# EAGLE design vilnius_rev_c (EAGLE 6.6.0)

## Sheet 1 of 2
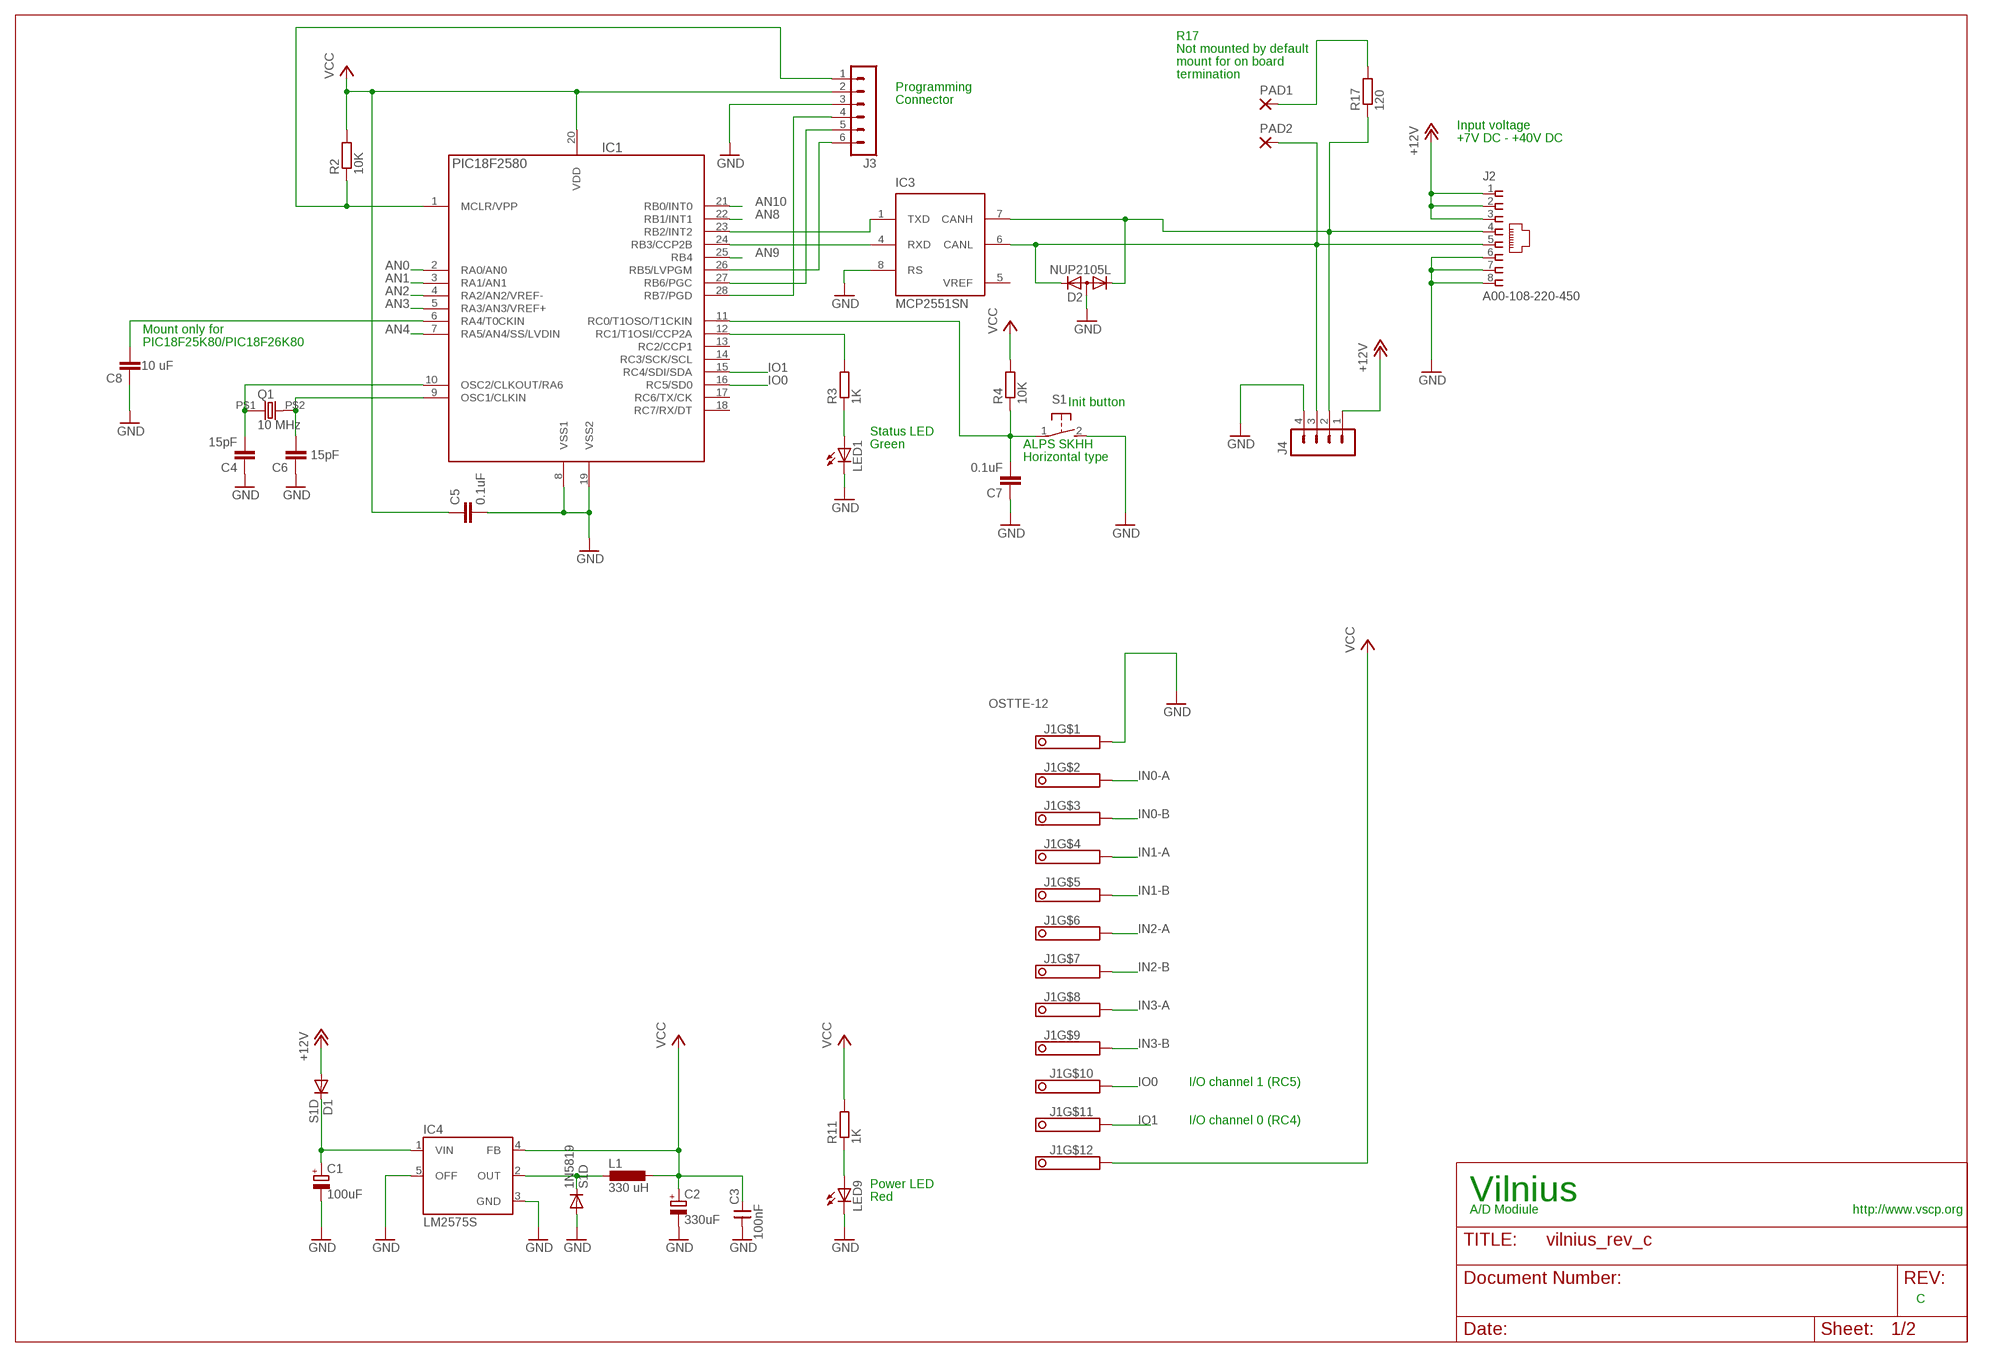
[diagram p0: schematic, sheet 1]

### Parts
1N5819  S1D  DIODE-SOD123  [SOD123]
C1  100uF  CPOL-EUD  [PANASONIC_D]
C2  330uF  CPOL-EUD  [PANASONIC_D]
C3  100nF  CNP-0805  [0805]
C4  15pF  C-EUC0805  [C0805]
C5  0.1uF  C-EUC0805  [C0805]
C6  15pF  C-EUC0805  [C0805]
C7  0.1uF  C-EUC0805  [C0805]
C8  10 uF  C-EUC0805  [C0805]
D1  S1D  DIODE-SOD123  [SOD123]
D2  NUP2105L  DIODE-2CA|ACSOT23  [SOT23@1]
IC1  PIC18F2580  PIC18LF252-I/SO  [SO28]
IC3  MCP2551SN  [SO-08]
IC4  LM2575S  [TO263-5]
J1  OSTTE-12  [PINHEAD-12]
J2  A00-108-220-450  [RJ-45]
J3  MA06-1  [MA06-1]
J4  MA04-1  [MA04-1]
L1  330 uH  DO3316P  [DO3316P]
LED1  LEDCHIP-LED0805  [CHIP-LED0805]
LED9  LEDCHIP-LED0805  [CHIP-LED0805]
PAD1  1,6/0,8  [1,6/0,8]
PAD2  1,6/0,8  [1,6/0,8]
Q1  10 MHz  HC-49S  [9C]
R2  10K  R-EU_R0805  [R0805]
R3  1K  R-EU_R0805  [R0805]
R4  10K  R-EU_R0805  [R0805]
R11  1K  R-EU_R0805  [R0805]
R17  120  R-EU_R0805  [R0805]
S1  31-XX  [B3F-31XX]

### Nets
+12V: D1.A J2.1 J2.2 J2.3 J4.1
AN0: IC1.2(RA0/AN0) ; also sheet 2
AN1: IC1.3(RA1/AN1) ; also sheet 2
AN2: IC1.4(RA2/AN2/VREF-) ; also sheet 2
AN3: IC1.5(RA3/AN3/VREF+) ; also sheet 2
AN4: IC1.7(RA5/AN4/SS/LVDIN)
AN8: IC1.22(RB1/INT1)
AN9: IC1.25(RB4)
AN10: IC1.21(RB0/INT0)
CANL: D2.2(K2) IC3.6(CANL) J2.5 J4.3 PAD2.1(P)
GND: 1N5819.A C1.- C2.- C3.1 C4.1 C5.2 C6.1 C7.1 C8.1 D2.3(A) IC1.8(VSS1) IC1.19(VSS2) IC3.8(RS) IC4.3(GND) IC4.5(OFF) J1.1 J2.6 J2.7 J2.8 J3.3 J4.4 LED1.C LED9.C S1.2(S) ; also sheet 2
IN0-A: J1.2 ; also sheet 2
IN0-B: J1.3 ; also sheet 2
IN1-A: J1.4 ; also sheet 2
IN1-B: J1.5 ; also sheet 2
IN2-A: J1.6 ; also sheet 2
IN2-B: J1.7 ; also sheet 2
IN3-A: J1.8 ; also sheet 2
IN3-B: J1.9 ; also sheet 2
IO0: IC1.16(RC5/SD0) J1.10
IO1: IC1.15(RC4/SDI/SDA) J1.11
N$1: 1N5819.C IC4.2(OUT) L1.1
N$2: C4.2 IC1.10(OSC2/CLKOUT/RA6) Q1.P$1
N$3: C1.+ D1.C IC4.1(VIN)
N$4: IC1.12(RC1/T1OSI/CCP2A) R3.2
N$5: LED1.A R3.1
N$6: C7.2 IC1.11(RC0/T1OSO/T1CKIN) R4.1 S1.1(P)
N$7: C6.2 IC1.9(OSC1/CLKIN) Q1.P$2
N$8: C8.2 IC1.6(RA4/T0CKIN)
N$11: PAD1.1(P) R17.2
N$12: IC1.1(MCLR/VPP) J3.1 R2.1
N$13: IC1.28(RB7/PGD) J3.4
N$14: IC1.27(RB6/PGC) J3.5
N$15: IC1.26(RB5/LVPGM) J3.6
N$20: LED9.A R11.1
N$22: D2.1(K1) IC3.7(CANH) J2.4 J4.2 R17.1
RXCAN: IC1.24(RB3/CCP2B) IC3.4(RXD)
TXCAN: IC1.23(RB2/INT2) IC3.1(TXD)
VCC: C2.+ C3.2 C5.1 IC1.20(VDD) IC4.4(FB) J1.12 J3.2 L1.2 R2.2 R4.2 R11.2 ; also sheet 2
Unconnected: IC1.13(RC2/CCP1) IC1.14(RC3/SCK/SCL) IC1.17(RC6/TX/CK) IC1.18(RC7/RX/DT)

### Notes on the sheet
- R17
- Not mounted by default
- mount for on board
- termination
- Programming
- Connector
- Input voltage
- +7V DC - +40V DC
- Mount only for
- PIC18F25K80/PIC18F26K80
- Init button
- Status LED
- Green | ALPS SKHH
- Horizontal type
- I/O channel 1 (RC5)
- I/O channel 0 (RC4)
- Power LED
- Red | Vilnius
- A/D Modiule | http://www.vscp.org
- C

## Sheet 2 of 2
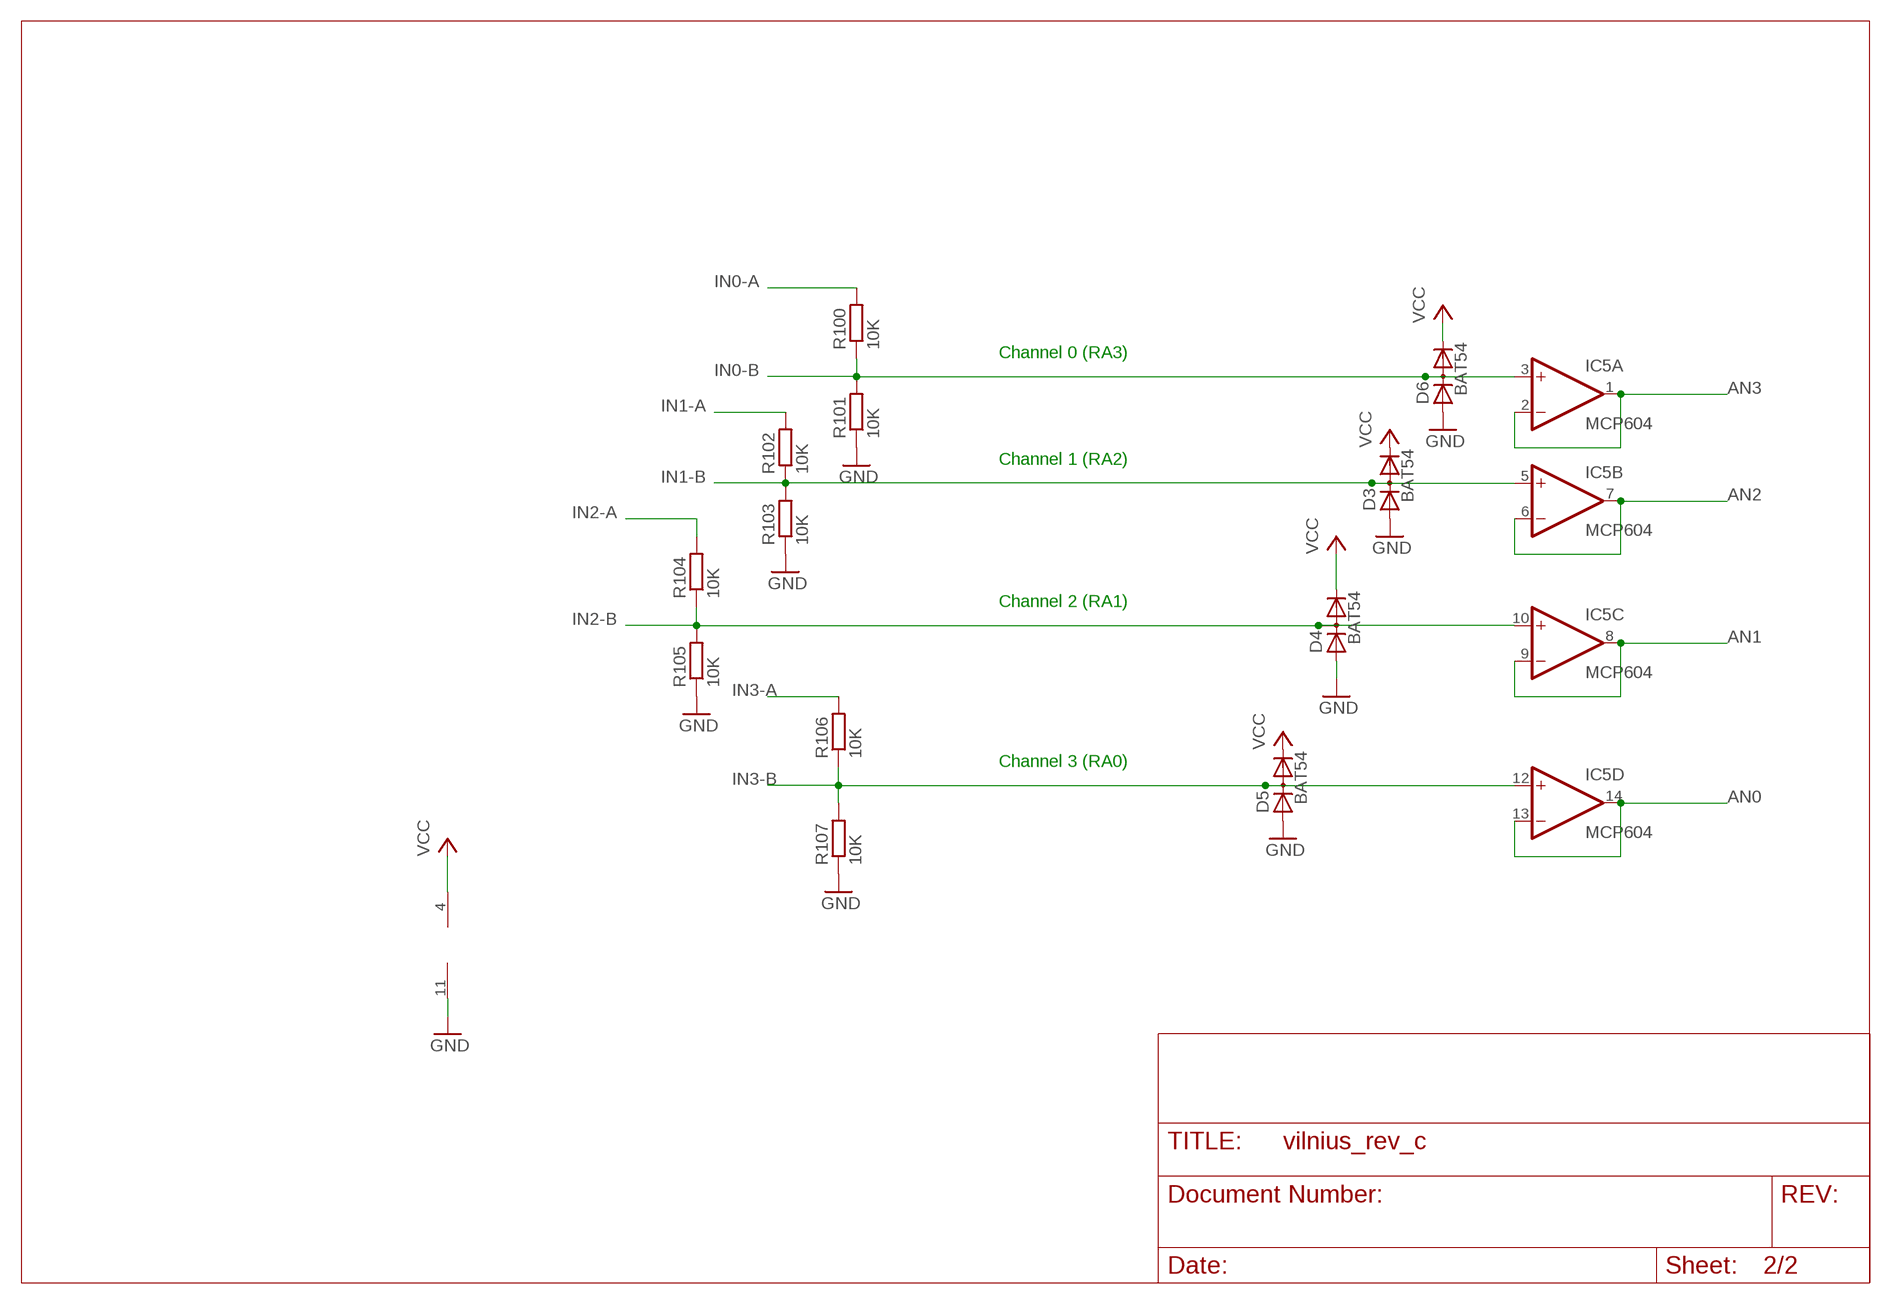
[diagram p1: schematic, sheet 2]

### Parts
D3  BAT54  BAV199  [SOT23]
D4  BAT54  BAV199  [SOT23]
D5  BAT54  BAV199  [SOT23]
D6  BAT54  BAV199  [SOT23]
IC5  MCP604  4AMP_P4+11D  [SO14]
R100  10K  R-EU_R0805  [R0805]
R101  10K  R-EU_R0805  [R0805]
R102  10K  R-EU_R0805  [R0805]
R103  10K  R-EU_R0805  [R0805]
R104  10K  R-EU_R0805  [R0805]
R105  10K  R-EU_R0805  [R0805]
R106  10K  R-EU_R0805  [R0805]
R107  10K  R-EU_R0805  [R0805]

### Nets
AN0: IC5.13(D:-IN) IC5.14(D:OUT) ; also sheet 1
AN1: IC5.8(C:OUT) IC5.9(C:-IN) ; also sheet 1
AN2: IC5.6(B:-IN) IC5.7(B:OUT) ; also sheet 1
AN3: IC5.1(A:OUT) IC5.2(A:-IN) ; also sheet 1
GND: D3.1(A) D4.1(A) D5.1(A) D6.1(A) IC5.11(P:V-) R101.1 R103.1 R105.1 R107.1 ; also sheet 1
IN0-A: R100.2 ; also sheet 1
IN0-B: D6.3(AC) IC5.3(A:+IN) R100.1 R101.2 ; also sheet 1
IN1-A: R102.2 ; also sheet 1
IN1-B: D3.3(AC) IC5.5(B:+IN) R102.1 R103.2 ; also sheet 1
IN2-A: R104.2 ; also sheet 1
IN2-B: D4.3(AC) IC5.10(C:+IN) R104.1 R105.2 ; also sheet 1
IN3-A: R106.2 ; also sheet 1
IN3-B: D5.3(AC) IC5.12(D:+IN) R106.1 R107.2 ; also sheet 1
VCC: D3.2(C) D4.2(C) D5.2(C) D6.2(C) IC5.4(P:V+) ; also sheet 1

### Notes on the sheet
- Channel 0 (RA3)
- Channel 1 (RA2)
- Channel 2 (RA1)
- Channel 3 (RA0)

## Power pins joined to a net without a drawn wire
GND: IC3.2(VSS)
VCC: IC3.3(VDD)
VREF: IC3.5(VREF)

## Library data of the parts
1N5819 D1 = diode:DIODE-: DIODE
C1 C2 = rcl:CPOL-EU: POLARIZED CAPACITOR, European symbol
C3 = cap-master:CNP-: NON-POLARIZED CAP
C4-C8 = rcl:C-EU: CAPACITOR, European symbol
D2 = diode:DIODE-2CA|AC: Dual DIODE Cathode-Anode|Anode-Cathode
D3-D6 = diode:BAV199: DIODE low-leakage double diode
IC1 = pic_olin:PIC18*F252-?: 18F252, 28 pin, 32Kb prog, 1536 data, 256 EEPROM
IC3 = microchip_can:MCP2551: High Speed CAN tranceiver
IC4 = v-reg-3:LM2575: National Semiconductor <http://www.national.com> 1.0A "Simple Switcher"(c) 52kHz, Vout 1.23-37V (HV: 57V), Vin 40V (HV: 60V), 50µA standby current
IC5 = linear:4AMP_P4+11: OP AMP
J1 = vscpcan:OSTTE-12
J2 = vscpcan:A00-108-220-450
J3 = con-lstb:MA06-1: PIN HEADER; OC_FARNELL: unknown; OC_NEWARK: unknown
J4 = con-lstb:MA04-1: PIN HEADER; OC_FARNELL: unknown; OC_NEWARK: unknown
L1 = inductor-coilcraft:DO3316P: COILCRAFT; OC_FARNELL: unknown; OC_NEWARK: unknown
LED1 LED9 = led:LED: LED OSRAM: - CHIPLED LG R971, LG N971, LY N971, LG Q971, LY Q971, LO R971, LY R971 LH N974, LH R974 LS Q976, LO Q976, LY Q976 LO Q996 - Hyper CHIPLED LW Q18S LB Q993, LB Q99A, LB R99A - SideLED LS A670, LO A670, LY A670, LG A670, LP A670 LB A673, LV A673, LT A673, LW A673 LH A674 LY A675 LS A676, LA A676, LO A676, LY A676, LW A676 LS A679, LY A679, LG A679 - Hyper Micro SIDELED® LS Y876, LA Y876, LO Y876, LY Y876 LT Y87S - SmartLED LW L88C, LW L88S LB L89C, LB L89S, LG L890 LS L89K, LO L89K, LY L89K LS L896, LA L896, LO L896, LY L896 - TOPLED LS T670, LO T670, LY T670, LG T670, LP T670 LSG T670, LSP T670, LSY T670, LOP T670, LYG T670 LG T671, LOG T671, LSG T671 LB T673, LV T673, LT T673, LW T673 LH T674 LS T676, LA T676, LO T676, LY T676, LB T676, LH T676, LSB T676, LW T676 LB T67C, LV T67C, LT T67C, LS T67K, LO T67K, LY T67K, LW E67C LS E67B, LA E67B, LO E67B, LY E67B, LB E67C, LV E67C, LT E67C LW T67C LS T679, LY T679, LG T679 LS T770, LO T770, LY T770, LG T770, LP T770 LB T773, LV T773, LT T773, LW T773 LH T774 LS E675, LA E675, LY E675, LS T675 LS T776, LA T776, LO T776, LY T776, LB T776 LHGB T686 LT T68C, LB T68C - Hyper Mini TOPLED® LB M676 - Mini TOPLED Santana® LG M470 LS M47K, LO M47K, LY M47K Source: http://www.osram.convergy.de LUXEON: - LUMILED® LXK2-PW12-R00, LXK2-PW12-S00, LXK2-PW14-U00, LXK2-PW14-V00 LXK2-PM12-R00, LXK2-PM12-S00, LXK2-PM14-U00 LXK2-PE12-Q00, LXK2-PE12-R00, LXK2-PE12-S00, LXK2-PE14-T00, LXK2-PE14-U00 LXK2-PB12-K00, LXK2-PB12-L00, LXK2-PB12-M00, LXK2-PB14-N00, LXK2-PB14-P00, LXK2-PB14-Q00 LXK2-PR12-L00, LXK2-PR12-M00, LXK2-PR14-Q00, LXK2-PR14-R00 LXK2-PD12-Q00, LXK2-PD12-R00, LXK2-PD12-S00 LXK2-PH12-R00, LXK2-PH12-S00 LXK2-PL12-P00, LXK2-PL12-Q00, LXK2-PL12-R00 Source: www.luxeon.com KINGBRIGHT: KA-3528ASYC Source: www.kingbright.com
PAD1 PAD2 = wirepad:1,6/0,8: THROUGH-HOLE PAD
Q1 = vscpcan:HC-49S: Digikey 887-1050-1-nd
R2-R4 R11 R17 R100-R107 = rcl:R-EU_: RESISTOR, European symbol
S1 = switch-omron:31-XX: OMRON SWITCH; MPN: B3F-3100; OC_FARNELL: 959704; OC_NEWARK: 36M3582

## Board
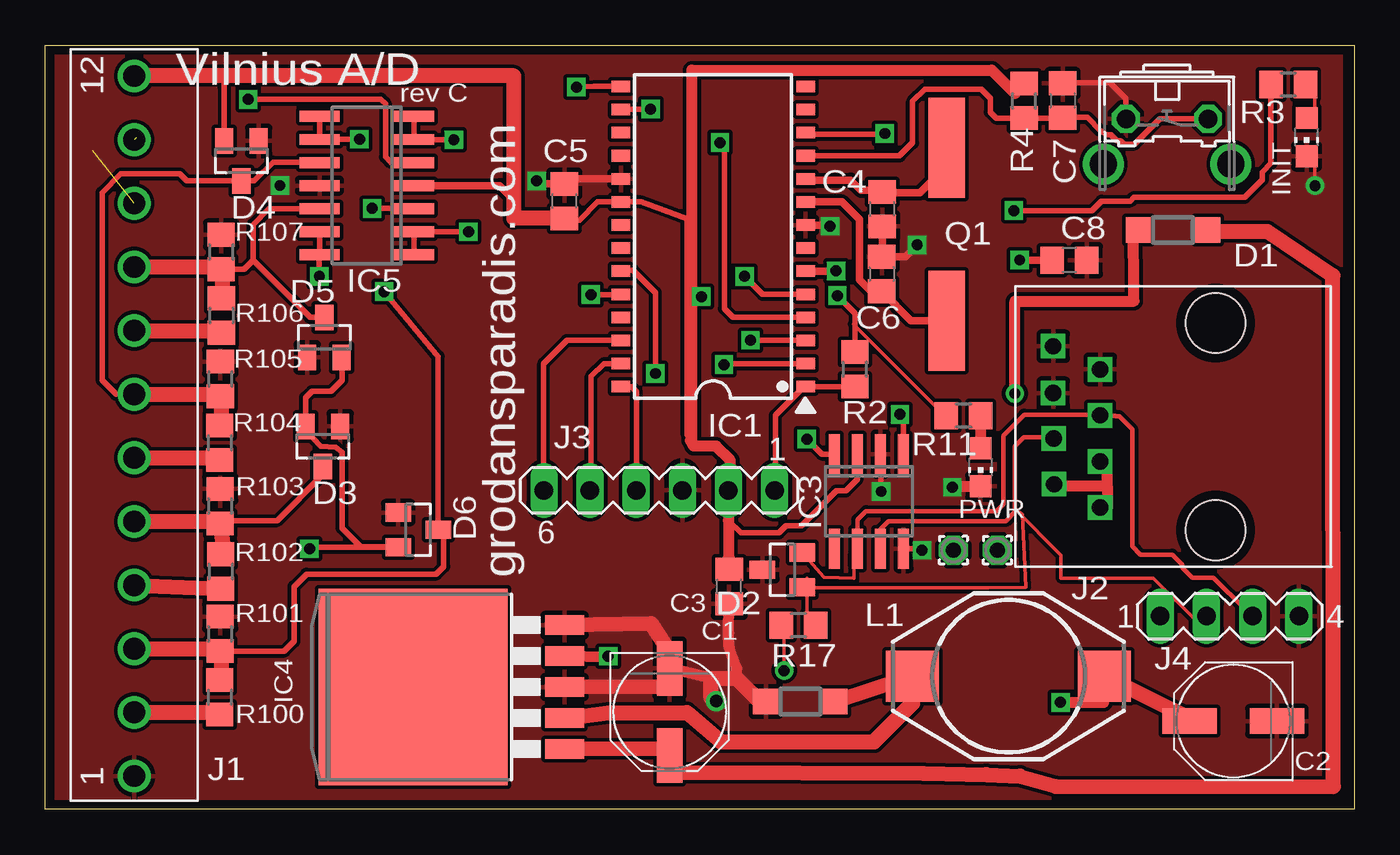
[diagram p2: board, top side]
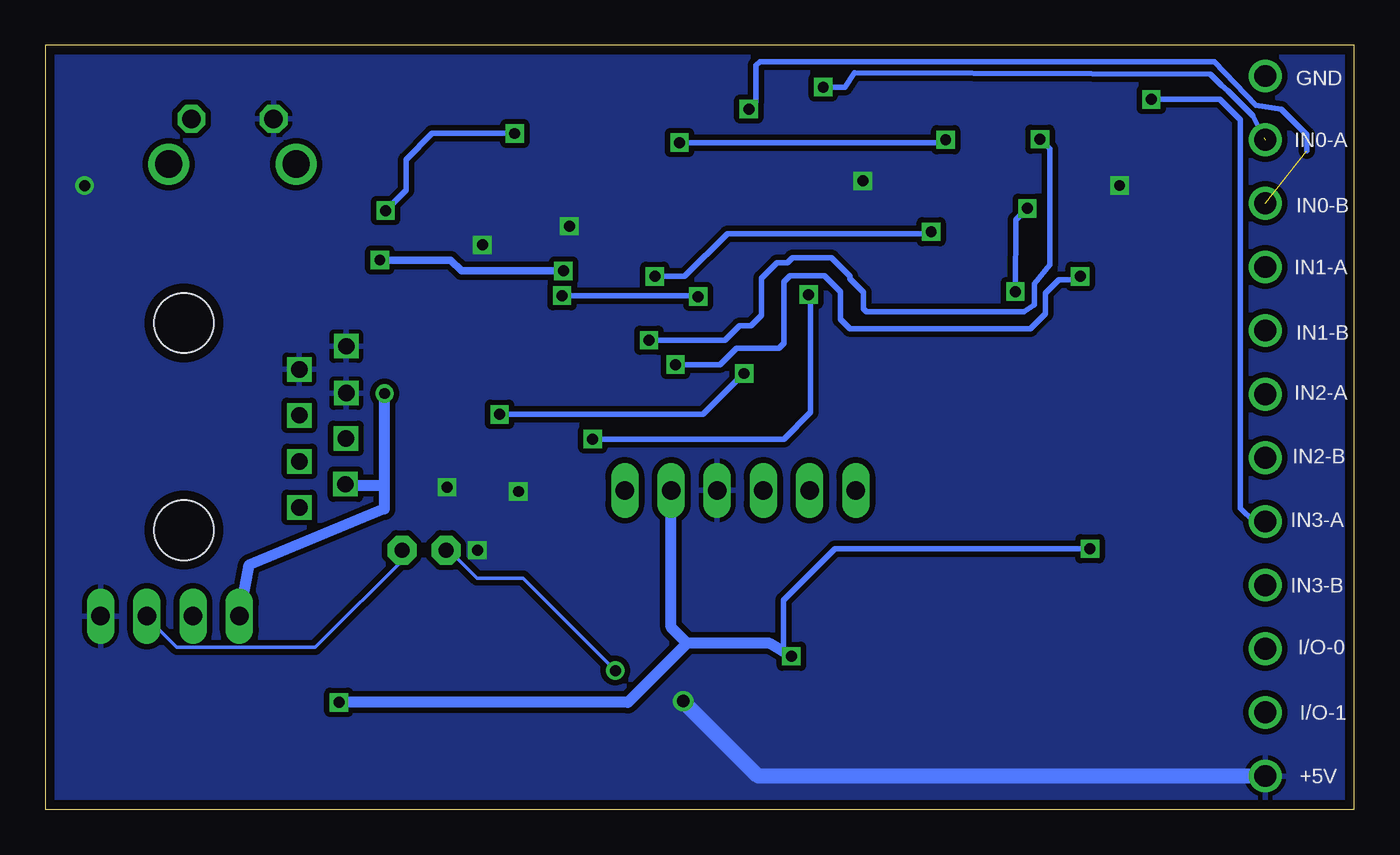
[diagram p3: board, bottom side, seen from below]

Size 72 x 42 mm. Coordinates in mm from the lower left corner, seen from the top.
Outline: 0,0 0,42 72,42 72,0 0,0
Copper layers (1*16): Top 0.035mm / dielectric 1.5mm / Bottom 0.035mm
Design rules "8mils": minimum track width 8mil, minimum drill 0.6mm, track to track 8mil, track to pad 8mil, pad to pad 8mil, via to via 8mil, smd to smd 0mil, copper to edge 20mil, drill to drill 10mil, minimum pad ring 8mil, minimum via ring 8mil, stop-mask expansion 0mil, vias tented up to drill 0mil, thermal gap 10mil

### Footprints (pad centres in the part's own frame; a part is rotated, then mirrored left to right if it is on the bottom)
SOD123 = smd 1.4 x 1.4: A 1.9,0; C -1.9,0
PANASONIC_D = smd 3 x 1.4: + 2.4,0; - -2.4,0
0805 = smd 1.27 x 1.524: 1 -0.953,0; 2 0.953,0
C0805 = smd 1.3 x 1.5: 1 -0.95,0; 2 0.95,0
SOT23@1 = smd 1 x 1.4: 1 -0.95,-1.1; 2 0.95,-1.1; 3 0,1.1
SOT23 = smd 1 x 1.4: 1 -0.95,-1.1; 2 0.95,-1.1; 3 0,1.1
SO28 = smd 0.635 x 1.016: 1 -8.255,-5.08; 2 -6.985,-5.08; 3 -5.715,-5.08; 4 -4.445,-5.08; 5 -3.175,-5.08; 6 -1.905,-5.08; 7 -0.635,-5.08; 8 0.635,-5.08; 9 1.905,-5.08; 10 3.175,-5.08; 11 4.445,-5.08; 12 5.715,-5.08; 13 6.985,-5.08; 14 8.255,-5.08; 15 8.255,5.08; 16 6.985,5.08; 17 5.715,5.08; 18 4.445,5.08; 19 3.175,5.08; 20 1.905,5.08; 21 0.635,5.08; 22 -0.635,5.08; 23 -1.905,5.08; 24 -3.175,5.08; 25 -4.445,5.08; 26 -5.715,5.08; 27 -6.985,5.08; 28 -8.255,5.08
SO-08 = smd 0.6 x 2.2: 1 -1.905,-2.6; 2 -0.635,-2.6; 3 0.635,-2.6; 4 1.905,-2.6; 5 1.905,2.6; 6 0.635,2.6; 7 -0.635,2.6; 8 -1.905,2.6
TO263-5 = smd 1.067 x 2.159: 1 -3.404,-5.791; 2 -1.702,-5.791; 3 0,-5.791; 4 1.702,-5.791; 5 3.404,-5.791 | smd 10.8 x 10.41: 6 0,2.54
SO14 = smd 0.6 x 2.2: 1 -3.81,-2.6; 2 -2.54,-2.6; 3 -1.27,-2.6; 4 0,-2.6; 5 1.27,-2.6; 6 2.54,-2.6; 7 3.81,-2.6; 8 3.81,2.6; 9 2.54,2.6; 10 1.27,2.6; 11 0,2.6; 12 -1.27,2.6; 13 -2.54,2.6; 14 -3.81,2.6
PINHEAD-12 = drill 1.2: 1 -17.5,0; 2 -14,0; 3 -10.5,0; 4 -7,0; 5 -3.5,0; 6 0,0; 7 3.5,0; 8 7,0; 9 10.5,0; 10 14,0; 11 17.5,0; 12 21,0
RJ-45 = drill 0.9 square: 1 -4.45,6.35; 2 -3.17,8.89; 3 -1.92,6.36; 4 -0.65,8.91; 5 0.62,6.35; 6 1.84,8.93; 7 3.14,6.35; 8 4.42,8.93 | hole 3.3: -5.7,0; 5.7,0
MA06-1 = drill 1.016 long: 1 -6.35,0; 2 -3.81,0; 3 -1.27,0; 4 1.27,0; 5 3.81,0; 6 6.35,0
MA04-1 = drill 1.016 long: 1 -3.81,0; 2 -1.27,0; 3 1.27,0; 4 3.81,0
DO3316P = smd 2.92 x 2.79: 1 -5.28,0; 2 5.28,0
CHIP-LED0805 = smd 1.2 x 1.2: A 0,-1.05; C 0,1.05
1,6/0,8 = drill 0.813 pad 1.6 octagon: 1 0,0
9C = smd 5.5 x 2: P$1 -4.74,0; P$2 4.76,0
R0805 = smd 1.3 x 1.5: 1 -0.95,0; 2 0.95,0
B3F-31XX = drill 1.016 octagon: 1 -2.261,-1.245; 2 2.261,-1.245 | drill 1.499 pad 2.159: 3 -3.505,1.245; 4 3.505,1.245

### Placement (x,y rotation side)
1N5819  41.53,5.91 180 top
C1  34.34,5.34 270 top
C2  65.36,4.84 180 top
C3  37.62,12.24 90 top
C4  46.04,33 90 top
C5  28.55,33.44 90 top
C6  46.01,29.43 270 top
C7  55.97,38.97 270 top
C8  56.34,30.19 180 top
D1  62.04,31.86 180 top
D2  40.54,13.16 90 top
D3  15.26,19.95 180 top
D4  10.78,35.65 180 top
D5  15.35,25.95 0 top
D6  20.51,15.36 270 top
IC1  36.74,31.49 90 top
IC3  45.31,16.93 180 top
IC4  22.77,6.71 90 top
IC5  17.68,34.29 90 top
J1  4.88,19.32 90 top
J2  64.38,21.04 90 top
J3  33.77,17.53 180 top
J4  65.15,10.61 0 top
L1  52.99,7.31 0 top
LED1  69.39,36.96 180 top
LED9  51.45,18.8 180 top
PAD1  49.96,14.24 0 top
PAD2  52.38,14.24 0 top
Q1  49.58,31.63 270 top
R2  44.54,24.19 90 top
R3  68.38,39.85 180 top
R4  53.84,38.95 90 top
R11  50.51,21.64 180 top
R17  41.43,10.11 180 top
R100  9.59,6.15 270 top
R101  9.61,9.64 270 top
R102  9.64,13.07 270 top
R103  9.61,16.66 270 top
R104  9.59,20.15 270 top
R105  9.62,23.66 270 top
R106  9.68,27.15 270 top
R107  9.67,30.64 270 top
S1  61.71,36.72 180 top

### Tracks (layer width: path | path; a pad name or v marks a point on that pad's centre or on a via)
+12V  (via drill 0.6)
  Top 0.203: J2.2 55.88,17.78 | D1.A 59.69,31.75 59.85,31.75
  Top 0.406: D1.A 59.82,31.84
  Top 0.61: 55.88,17.78 58.42,17.78 | 58.42,17.78 58.42,19.05 J2.3 | 58.42,17.78 58.42,16.51 J2.1 | 59.85,31.75 59.89,28.79 59.89,27.94 53.34,27.94 v53.34,22.86
  Bottom 0.61: 53.34,17.78 53.34,16.51 60.81,13.4 J4.1 | 53.34,17.78 v53.34,22.86 | 53.34,17.78 55.88,17.78 J2.2
AN0  (via drill 0.6)
  Top 0.305: IC5.13 IC5.14 v15.07,29.3 | IC1.2 37.38,24.5 v37.33,24.45
  Bottom 0.305: v37.33,24.45 34.88,24.45 33.97,25.36 31.63,25.36 31.36,25.63 31.36,29.01 31.04,29.33 29.13,29.33 28.25,28.45 28.25,26.94 27.74,26.43 17.81,26.43 16.99,27.25 16.99,28.37 16.24,29.12 15.25,29.12 v15.07,29.3
AN1  (via drill 0.6)
  Top 0.305: IC5.8 IC5.9 v17.28,36.84 | IC1.3 38.8,25.77 v38.79,25.79
  Bottom 0.305: v38.79,25.79 34.61,25.79 33.81,26.59 33.19,26.59 32.61,27.17 32.61,29.2 31.76,30.05 31.18,30.05 30.91,30.32 28.76,30.32 27.74,29.3 27.74,29.16 27,28.42 27,27.52 26.84,27.36 18.18,27.36 17.59,27.74 17.59,28.89 16.75,29.94 16.75,36.31 v17.28,36.84
AN2  (via drill 0.6)
  Top 0.305: IC5.7 IC5.6 20.3,36.81 v22.47,36.81 | IC1.4 37.83,27.05 37.35,27.52 37.35,36.42 v37.11,36.66
  Bottom 0.305: v37.11,36.66 22.62,36.66 v22.47,36.81
AN3  (via drill 0.6)
  Top 0.305: IC5.1 IC5.2 v23.27,31.75 | IC1.5 39.45,28.32 v38.47,29.3
  Bottom 0.305: v38.47,29.3 36.83,29.3 34.48,31.65 23.37,31.65 v23.27,31.75
CANL
  Top 0.203: D2.2 42.82,12.74 44.48,12.7 44.45,13.97 IC3.6
  Top 0.254: IC3.6 44.67,15.91 45.15,16.39 52.31,16.39 52.7,16.78 52.7,20.54 53.86,21.7 57.99,21.7 J2.5 58.05,21.64 58.85,21.64 58.88,21.61 59.08,21.61 59.79,20.9 59.79,14.45 60.25,13.99 61.99,13.99 62.54,13.44 62.54,13.28 63.09,12.73 64.26,12.73 64.7,12.29 J4.3
  Bottom 0.203: PAD2.1 52.07,13.97 57.15,8.89 64.77,8.89 66.04,10.16 J4.3
GND  (via drill 0.6, 0.7)
  Top 0.203: v69.85,34.29 69.85,35.56 LED1.C
  Top 0.254: 36.63,7.18 36.63,7.36
  Top 0.305: IC3.8 48.14,14.33 v48.23,14.24 | v45.98,17.47 45.98,19.5 IC3.2 | S1.2 59.45,39.06 58.55,39.96 56.01,39.96 C7.1 | D4.1 11.73,36.49 | R107.1 9.3,31.86
  Top 0.406: IC1.19 28.82,34.66 C5.2 27.19,34.39 v27.03,34.55 | 45.97,32.12 C4.1 46.04,30.41 C6.1 47.31,30.38 v47.96,31.03 | IC1.8 43.1,32.12 v43.17,32.06
  Top 0.61: 34.65,6.72 34.33,6.65 34.62,7.21 34.65,7.18 | 34.65,7.18 34.7,7.13 | C1.- 34.65,7.18 | 39.42,5.79 39.33,5.88 1N5819.A 39.48,5.91 | 36.63,7.18 C1.- | 39.48,5.91 39.58,5.81 | 39.48,5.91 38.93,6.46 | 34.44,7.15 34.34,7.05 | C1.- 34.44,7.15 | 34.47,8.45 34.47,7.18 34.44,7.15 | v36.91,5.94 36.63,6.09 | 38.02,7.18 38.02,7.75 37.61,8.89 37.58,9.68 C3.1 | LED9.C 49.95,17.75 v49.9,17.7
  Top 0.813: 34.65,6.72 IC4.3 | 39.33,5.88 38.02,7.18 36.63,7.18 36.63,6.09 | IC4.5 33.34,10.21 34.47,8.45
  Bottom 0.813: J1.1 32.79,1.82 v36.91,5.94
  other vias: 12.9,34.3
  pour Bottom (isolate 0.305): -0.3,1.58 1.36,-1.77 71.34,-2.14 73.38,1.23 73.1,34.4 71.52,43.66 0.13,43.56 -0.79,33.98
  pour Top: 0.97,41.52 0.56,41.52 0.56,0.32 71.6,0.32 71.6,0.81 71.28,0.81 71.28,41.6 1.5,42.6 0.2,43.15
IN0-A
  Top 0.813: J1.2 9.67,5.32 R100.2
IN0-B  (via drill 0.6)
  Top 0.305: R101.2 13.14,8.69 13.68,9.23 13.68,12.24 14.36,12.92 21.5,12.92 21.91,13.33 21.91,15.06 D6.3 21.61,24.89 v18.63,28.46 | v17.97,33.04 20.26,33.04 IC5.3
  Top 0.813: J1.3 9.68,8.82 R101.2 9.71,7.02 R100.1
  Bottom 0.305: v18.63,28.46 18.6,32.41 v17.97,33.04
IN1-A
  Top 0.813: J1.4 R102.2
IN1-B  (via drill 0.6)
  Top 0.305: D3.3 15.26,18.38 12.74,15.86 9.86,15.86 R103.2 | IC5.5 19.02,35.56 18.71,35.87 18.71,38.79 18.45,39.05 11.17,39.05 v11.15,39.03
  Top 0.813: J1.5 9.8,15.82 R103.2 9.81,14.09 R102.1
  Bottom 0.305: v11.15,39.03 7.38,39.03 6.27,37.92 6.27,16.56 5.53,15.82 J1.5
IN2-A
  Top 0.813: J1.6 9.77,19.32 R104.2
IN2-B
  Top 0.305: IC5.10 15.06,35.58 12.52,35.58 11.49,34.55 D4.3 7.78,34.55 7.39,34.94 4.14,34.94 3.11,33.91 3.11,23.59 3.89,22.81 R105.2
  Top 0.813: J1.7 9.71,22.82 R105.2 9.72,21.07 R104.1
IN3-A
  Top 0.813: J1.8 9.76,26.32 R106.2
IN3-B
  Top 0.305: IC5.12 12.29,33.02 11.42,32.15 11.42,30.18 | 11.42,30.18 10.94,29.7 9.78,29.7 R107.2 | D5.3 14.55,27.05 11.42,30.18
  Top 0.813: J1.9 9.64,29.82 R107.2 9.78,29.68 R106.1
IO0  (via drill 0.6)  (1 unrouted)
  Top 0.305: v33.3,38.5 31.68,38.5 IC1.16
  Bottom 0.305: 2.6,36.2 2.6,37.1 4,38.5 5.4,38.7 7.7,41.1 32.7,41.1 32.9,40.9 32.9,38.9 v33.3,38.5
IO1  (via drill 0.6)  (1 unrouted)
  Top 0.305: IC1.15 30.18,39.74 v29.21,39.71
  Bottom 0.305: v29.21,39.71 28,39.71 27.5,40.5 7.92,40.42 7.3,39.8 6.95,39.5 5.58,38.13 4.98,36.92
N$1
  Top 0.61: 47.83,5.86 47.78,5.91 L1.1 47.71,5.81 | IC4.2 28.65,4.95 28.53,4.89
  Top 0.813: L1.1 1N5819.C | 47.71,5.81 45.6,3.7 37.16,3.7 35.29,5.3 30.96,5.29 28.61,5 28.65,4.95
N$2
  Top 0.406: Q1.P$1 49.58,35.37 48.1,33.89 45.66,33.89 45.52,34.03 | 45.52,34.03 45.96,34.03 C4.2 | 45.52,34.03 44.87,34.03 44.3,34.6 41.88,34.6 IC1.10
N$3
  Top 0.406: 34.35,3.36 C1.+ 34.79,2.03 | D1.C 64.48,31.86 64.58,31.76
  Top 0.813: IC4.1 34.35,3.36 | 64.58,31.76 67.25,31.76 70.83,29.34 70.86,1.24 55.59,1.25 53.62,1.82 51.76,1.9 48.33,1.97 34.79,2.03
N$4  (via drill 0.6)
  Top 0.305: IC1.12 41.92,37.2 42.01,37.12 46.14,37.12 v46.18,37.16 | v53.28,32.92 57.58,32.92 58.1,33.44 59.69,33.44 59.89,33.64 65.98,33.64 66.96,34.62 66.96,35.04 67.43,35.51 R3.2
  Bottom 0.305: v46.18,37.16 50.73,37.16 52.17,35.72 52.17,34.03 v53.28,32.92
N$5
  Top 0.203: 69.85,39.37 69.85,38.1 LED1.A
  Top 0.254: 69.85,39.37 R3.1
N$6
  Top 0.305: IC1.11 41.84,35.92 46.99,35.92 47.71,36.64 47.71,38.92 48.39,39.6 51.49,39.6 51.98,39.11 51.98,38.33 52.31,38 R4.1 55.95,38 C7.2 55.99,38.04 57.32,38.04 58.07,37.29 58.13,37.29 58.33,37.09 58.62,37.09 58.95,36.76 59.14,36.76 59.33,36.57 59.92,36.57 61.31,37.97 S1.1
N$7
  Top 0.406: Q1.P$2 47.62,26.87 C6.2 45.41,28.48 44.78,29.11 44.78,32.45 43.83,33.4 IC1.9
N$8  (via drill 0.6)
  Top 0.406: IC1.6 43.5,29.59 v43.5,29.6 | v53.6,30.2 C8.2
  Bottom 0.406: v43.5,29.6 49.1,29.6 49.7,30.2 v53.6,30.2
N$11  (via drill 0.6)
  Top 0.203: v40.64,7.62 40.64,10.16 R17.2
  Bottom 0.203: v40.64,7.62 45.72,12.7 48.26,12.7 49.53,13.97 PAD1.1
N$12
  Top 0.305: IC1.1 R2.1 41.74,23.24 40.16,21.66 40.16,17.57 J3.1
N$13
  Top 0.305: IC1.28 32.24,23.23 32.52,22.96 32.52,17.55 J3.4
N$14
  Top 0.305: IC1.27 30.73,24.5 30.03,23.8 30.03,17.6 J3.5
N$15
  Top 0.305: IC1.26 28.68,25.77 27.41,24.5 J3.6
N$20
  Top 0.61: R11.1 LED9.A
N$22
  Top 0.203: R17.1 41.91,10.16 41.91,12.7 D2.1 41.72,12.17 51.88,12.17 53.94,12.21 53.74,16.21 53.35,16.51 53.34,16.51 55.88,13.97 55.88,12.7 60.96,12.7 63.5,10.16 J4.2
  Top 0.254: IC3.7 45.95,15.4 46.38,15.84 52.83,15.84 53.35,16.36 53.35,16.51 53.35,19.96 53.83,20.44 55.42,20.44 J2.4
RXCAN  (via drill 0.6)
  Top 0.305: IC3.4 42.71,19.53 v41.89,20.35 | v30.01,28.3 31.64,28.3 IC1.24
  Bottom 0.305: v41.89,20.35 31.37,20.35 29.9,21.82 29.9,28.19 v30.01,28.3
TXCAN  (via drill 0.6)
  Top 0.305: IC3.1 47.22,21.5 v47.01,21.71 | v33.56,23.96 33.56,28.41 32.32,29.65 31.73,29.65 IC1.23
  Bottom 0.305: v47.01,21.71 35.81,21.71 v33.56,23.96
VCC  (via drill 0.6)
  Top 0.203: R11.2 49.53,21.59 44.45,26.67 44.54,26.67 | 43.18,27.94 v43.58,28.24
  Top 0.254: 35.48,20.27 35.56,20.32 | 10.01,40.33 9.85,40.17
  Top 0.305: C5.1 28.65,32.39 29.38,32.39 30.39,33.4 IC1.20 32.77,33.4 35.3,32.48 35.3,28.08 | 35.3,28.08 35.3,20.58 35.48,20.27 | J3.2 37.68,17.63 | v30.96,8.41 30.86,8.36 | IC3.3 44.67,18.14 44.03,17.5 43.51,17.5 41.59,15.58 40.74,15.58 40.35,15.19 38.26,15.19 37.58,15.87 | 58.23,5.87 L1.2 | R2.2 44.54,26.67 44.54,27.28 v43.58,28.24 | v36.09,28.19 35.41,28.19 35.3,28.08 | D4.2 9.83,39.71 9.81,40.33 | D5.2 16.32,24.83 16.32,23.59 15.71,22.98 14.66,22.98 14.31,22.63 D3.2 14.31,20.83 15.14,19.95 15.96,19.91 16.32,19.62 16.32,15.46 17.34,14.44 19.38,14.44 D6.2 14.62,14.41 v14.53,14.32
  Top 0.406: 63.05,4.95 C2.+ | 5.48,40.33 J1.12 | IC5.4 24.99,34.29 25.78,33.5
  Top 0.61: 35.48,20.27 35.66,19.96 36.9,19.96 37.68,19.18 37.68,17.63 | 30.86,8.36 IC4.4 | C3.2 37.62,13.84 37.58,13.82 37.58,15.87 J3.2 | v55.85,5.87 58.23,5.87 | 35.56,20.32 35.56,40.64 52.07,40.64 53.34,39.37 R4.2
  Top 0.813: L1.2 63.05,4.95 | C5.1 25.78,32.49 25.78,33.5 25.78,40.33 10.01,40.33 9.81,40.33 5.48,40.33
  Bottom 0.305: v43.58,28.24 36.14,28.24 v36.09,28.19 | v14.53,14.32 28.57,14.32 31.39,11.5 31.39,8.84 v30.96,8.41
  Bottom 0.61: J3.2 37.58,9.99 36.71,9.12 | 36.71,9.12 32.14,9.12 v30.96,8.41 | v55.85,5.87 39.96,5.87 36.71,9.12

### Text on the board
tNames: Vilnius A/D | rev C | INIT | PWR | grodansparadis.com
bNames: GND | IN0-A | IN0-B | IN1-A | IN1-B | IN2-A | IN2-B | IN3-A | IN3-B | I/O-0 | I/O-1 | +5V